# Altium schematic sheet OnOffSolenoid.SchDoc
size A4
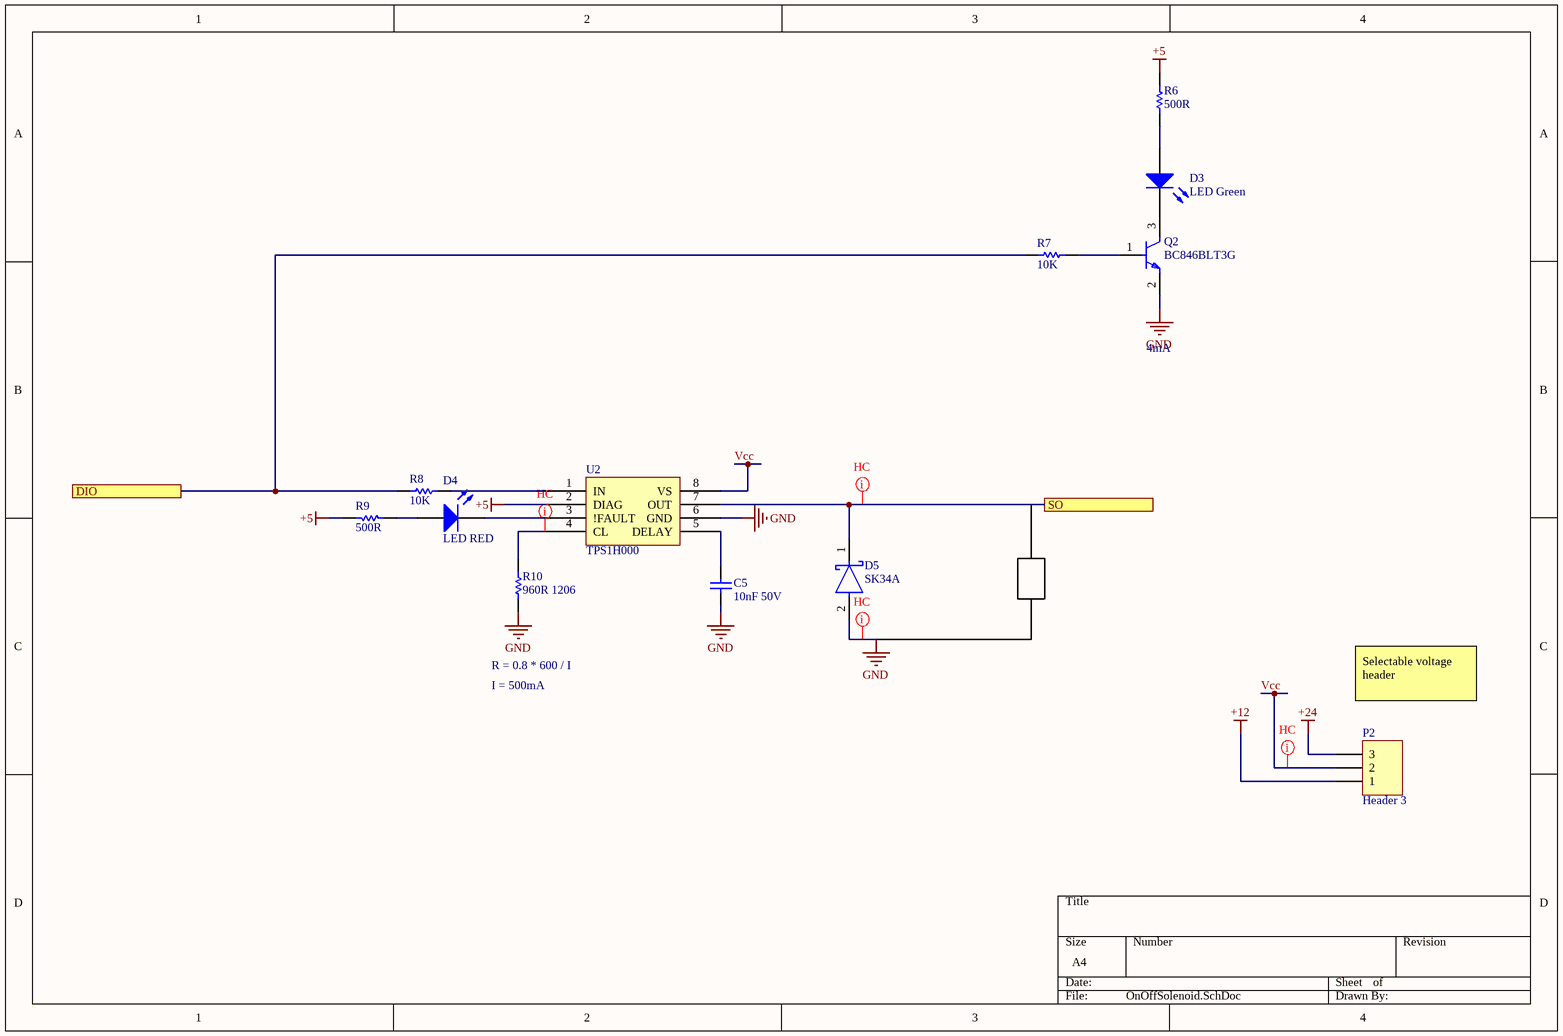
[diagram p0: OnOffSolenoid.SchDoc]

## Parts
C5  10nF 50V  [CAPC0603(1608)100_L]
D3  LED Green  [0603_A]
D4  LED RED  [0603_A]
D5  SK34A  [FP-DO-214AC-MFG]
P2  Header 3  [HDR1X3]
Q2  BC846BLT3G  [FP-318-08-IPC_C]
R6  500R  [RESC0603(1608)_L]
R7  10K  [RESC0603(1608)_N]
R8  10K  [RESC0603(1608)_N]
R9  500R  [RESC0603(1608)_L]
R10  960R 1206  [RESC1206(3216)_L]
U2  TPS1H000  [TSOP65P490X110_HS-9N]

## Ports
DIO, SO

## Nets
+5: R6.2 R9.2 U2.2(DIAG)
+12: P2.1
+24: P2.3
GND: C5.1 D5.2(A) Q2.2(E) R10.1 U2.6(GND)
DIO: R7.1 R8.1 ; port DIO
SO: D5.1(C) U2.7(OUT) ; port SO
Vcc: P2.2 U2.8(VS)
NetC5_2: C5.2 U2.5(DELAY)
NetD3_1: D3.1(K) Q2.3(C)
NetD3_2: D3.2(A) R6.1
NetD4_1: D4.1(K) U2.3(!FAULT)
NetD4_2: D4.2(A) R9.1
NetQ2_1: Q2.1(B) R7.2
NetR8_2: R8.2 U2.1(IN)
NetR10_2: R10.2 U2.4(CL)

## Layout directives
net class HC: GND, NetR10_2, SO, Vcc

## Notes on the sheet
- 4mA
- R = 0.8 * 600 / I
- I = 500mA
- Selectable voltage header

## Library data of the parts
C5 = CMP-1035-02322-1: CAP 10nF 50V ±20% 0603 (1608 Metric) Thickness 1mm SMD; Case-Metric: 1608; Tolerance: Â±20%; Case-EIA: 0603; Rated Voltage: 50 V; Value: 10nF; Max Thickness: 1 mm; Technology: SMT
D3 = CMP-1426-00002-1: SMD mono-color Chip LED, WL-SMCW, Green; PartNumber: 150060GS75000; Manufacturer: Wuerth Elektronik; ComponentLink1URL: http://www.we-online.com; ComponentLink2Description: Datasheet; Color: Green; ComponentLink2URL: http://katalog.we-online.com/led/datasheet/150060GS75000.pdf; PackageReference: 0603_A; ComponentLink1Description: Manufacturer URL
D4 = CMP-1426-00001-1: SMD mono-color Chip LED, WL-SMCW, Red; Manufacturer: Wuerth Elektronik; PartNumber: 150060RS75000; Color: Red; PackageReference: 0603_A; ComponentLink2URL: http://katalog.we-online.com/led/datasheet/150060RS75000.pdf; ComponentLink1URL: http://www.we-online.com; ComponentLink1Description: Manufacturer URL; ComponentLink2Description: Datasheet
D5 = CMP-56206-000004-1: DIODE SCHOTTKY 5A 30V SMA; Mount: Surface Mount; Max Reverse Voltage (DC): 30V; Case/Package: SMA; Packaging: Tape and Reel; Average Rectified Current: 5A
P2 = Header 3: Header, 3-Pin; LatestRevisionDate: 17-Jul-2002; LatestRevisionNote: Re-released for DXP Platform.; Publisher: Altium Limited
Q2 = CMP-07170-000022-1: TRANS NPN 65V 0.1A SOT-23; Number of Elements: 1; Collector Emitter Saturation Voltage: 600mV; Power Dissipation: 300mW; hFE Min: 200; Transition Frequency: 100MHz; Max Collector Current: 100mA; Collector Base Voltage (VCBO): 80V; Emitter Base Voltage (VEBO): 6V; Element Configuration: Single; REACH SVHC: No SVHC; Length: 2.9mm; Polarity: NPN; Max Breakdown Voltage: 65V; Case/Package: SOT-23-3; Max Operating Temperature: 150°C; Min Operating Temperature: -55°C; Voltage Rating (DC): 65V; Number of Pins: 3; Radiation Hardening: No; Package Quantity: 1; Contact Plating: Tin; Max Frequency: 100MHz; Width: 1.3mm; Max Power Dissipation: 300mW; Height: 1mm; Lead Free: Lead Free; Frequency: 100MHz; Halogen Free: Halogen Free; Collector Emitter Voltage (VCEO): 65V; Gain Bandwidth Product: 100MHz; Current Rating: 100mA; Collector Emitter Breakdown Voltage: 65V; Packaging: Tape and Reel
R6 R9 = CMP-1012-00067-1: 510R 0.1W 5% 0603 (1608 Metric)  SMD; Case-EIA: 0603; Value: 510.00 Ohm; Case-Metric: 1608; Technology: SMT; Power: 0.1 W; Tolerance: 5 %
R7 R8 = CMP-1012-00623-1: 10K 0.1W 1% 0603 (1608 Metric)  SMD; Value: 10000.00 Ohm; Case-EIA: 0603; Case-Metric: 1608; Power: 0.1 W; Tolerance: 1 %; Technology: SMT
R10 = CMP-1014-00508-1: 953R 0.25W 1% 1206 (3216 Metric)  SMD; Case-Metric: 3216; Value: 953.00 Ohm; Case-EIA: 1206; Tolerance: 1 %; Technology: SMT; Power: 0.25 W